# EAGLE schematic LED-Cube-Schematic (EAGLE 6.2)
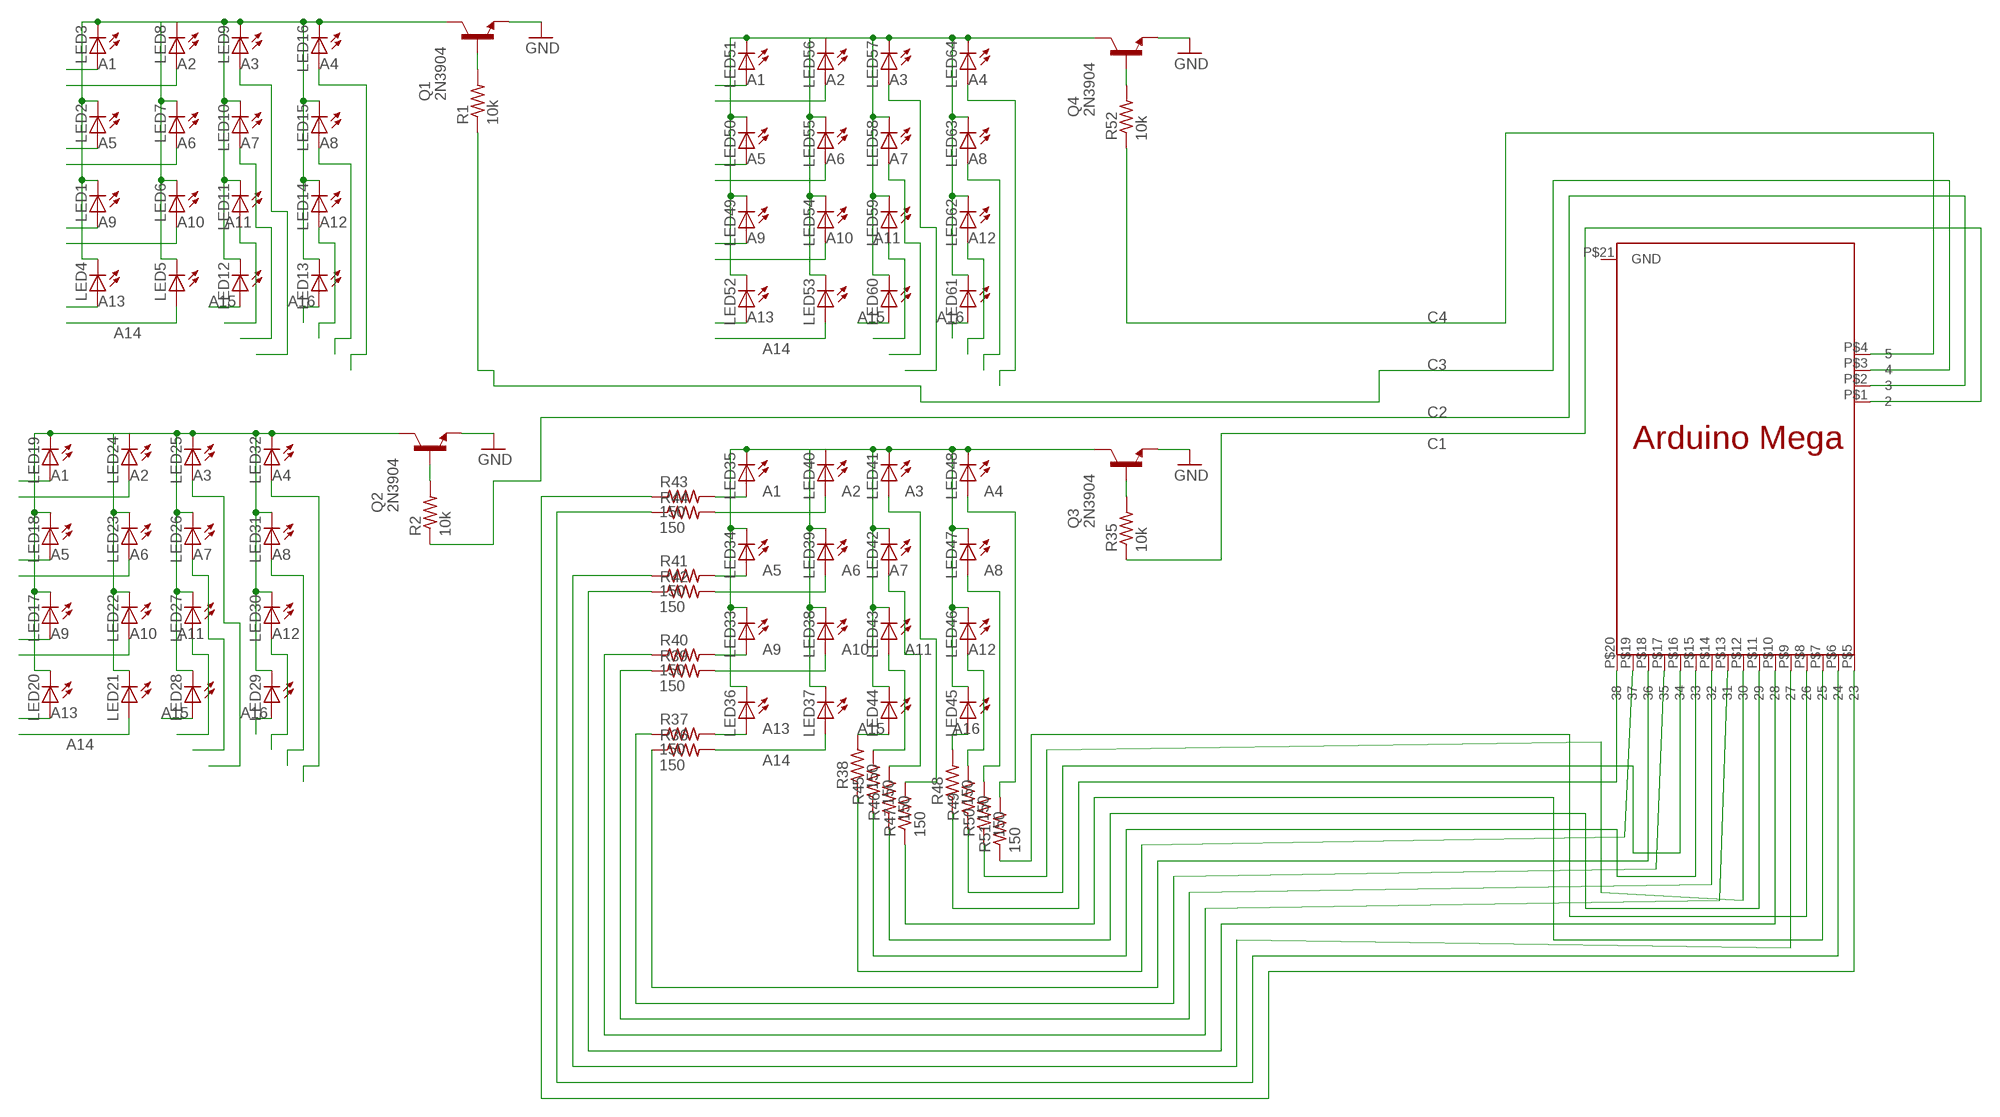
[diagram p0: schematic, sheet 1]

## Parts
LED1  LED3MM  [LED3MM]
LED2  LED3MM  [LED3MM]
LED3  LED3MM  [LED3MM]
LED4  LED3MM  [LED3MM]
LED5  LED3MM  [LED3MM]
LED6  LED3MM  [LED3MM]
LED7  LED3MM  [LED3MM]
LED8  LED3MM  [LED3MM]
LED9  LED3MM  [LED3MM]
LED10  LED3MM  [LED3MM]
LED11  LED3MM  [LED3MM]
LED12  LED3MM  [LED3MM]
LED13  LED3MM  [LED3MM]
LED14  LED3MM  [LED3MM]
LED15  LED3MM  [LED3MM]
LED16  LED3MM  [LED3MM]
LED17  LED3MM  [LED3MM]
LED18  LED3MM  [LED3MM]
LED19  LED3MM  [LED3MM]
LED20  LED3MM  [LED3MM]
LED21  LED3MM  [LED3MM]
LED22  LED3MM  [LED3MM]
LED23  LED3MM  [LED3MM]
LED24  LED3MM  [LED3MM]
LED25  LED3MM  [LED3MM]
LED26  LED3MM  [LED3MM]
LED27  LED3MM  [LED3MM]
LED28  LED3MM  [LED3MM]
LED29  LED3MM  [LED3MM]
LED30  LED3MM  [LED3MM]
LED31  LED3MM  [LED3MM]
LED32  LED3MM  [LED3MM]
LED33  LED3MM  [LED3MM]
LED34  LED3MM  [LED3MM]
LED35  LED3MM  [LED3MM]
LED36  LED3MM  [LED3MM]
LED37  LED3MM  [LED3MM]
LED38  LED3MM  [LED3MM]
LED39  LED3MM  [LED3MM]
LED40  LED3MM  [LED3MM]
LED41  LED3MM  [LED3MM]
LED42  LED3MM  [LED3MM]
LED43  LED3MM  [LED3MM]
LED44  LED3MM  [LED3MM]
LED45  LED3MM  [LED3MM]
LED46  LED3MM  [LED3MM]
LED47  LED3MM  [LED3MM]
LED48  LED3MM  [LED3MM]
LED49  LED3MM  [LED3MM]
LED50  LED3MM  [LED3MM]
LED51  LED3MM  [LED3MM]
LED52  LED3MM  [LED3MM]
LED53  LED3MM  [LED3MM]
LED54  LED3MM  [LED3MM]
LED55  LED3MM  [LED3MM]
LED56  LED3MM  [LED3MM]
LED57  LED3MM  [LED3MM]
LED58  LED3MM  [LED3MM]
LED59  LED3MM  [LED3MM]
LED60  LED3MM  [LED3MM]
LED61  LED3MM  [LED3MM]
LED62  LED3MM  [LED3MM]
LED63  LED3MM  [LED3MM]
LED64  LED3MM  [LED3MM]
Q1  2N3904  [TO92]
Q2  2N3904  [TO92]
Q3  2N3904  [TO92]
Q4  2N3904  [TO92]
R1  10k  R-US_0207/7  [0207/7]
R2  10k  R-US_0207/7  [0207/7]
R35  10k  R-US_0207/7  [0207/7]
R36  150  R-US_0207/7  [0207/7]
R37  150  R-US_0207/7  [0207/7]
R38  150  R-US_0207/7  [0207/7]
R39  150  R-US_0207/7  [0207/7]
R40  150  R-US_0207/7  [0207/7]
R41  150  R-US_0207/7  [0207/7]
R42  150  R-US_0207/7  [0207/7]
R43  150  R-US_0207/7  [0207/7]
R44  150  R-US_0207/7  [0207/7]
R45  150  R-US_0207/7  [0207/7]
R46  150  R-US_0207/7  [0207/7]
R47  150  R-US_0207/7  [0207/7]
R48  150  R-US_0207/7  [0207/7]
R49  150  R-US_0207/7  [0207/7]
R50  150  R-US_0207/7  [0207/7]
R51  150  R-US_0207/7  [0207/7]
R52  10k  R-US_0207/7  [0207/7]
U$1  MEGA  [MEGAPACKAGE]

## Nets
A1: LED3.A LED19.A LED35.A LED51.A R43.2
A2: LED8.A LED24.A LED40.A LED56.A R44.2
A3: LED9.A LED25.A LED41.A LED57.A R47.2
A4: LED16.A LED32.A LED48.A LED64.A R51.2
A5: LED2.A LED18.A LED34.A LED50.A R41.2
A6: LED7.A LED23.A LED39.A LED55.A R42.2
A7: LED10.A LED26.A LED42.A LED58.A R46.2
A8: LED15.A LED31.A LED47.A LED63.A R50.2
A9: LED1.A LED17.A LED33.A LED49.A R40.2
A10: LED6.A LED22.A LED38.A LED54.A R39.2
A11: LED11.A LED27.A LED43.A LED59.A R45.2
A12: LED14.A LED30.A LED46.A LED62.A R49.2
A13: LED4.A LED20.A LED36.A LED52.A R37.2
A14: LED5.A LED21.A LED37.A LED53.A R36.2
A15: LED12.A LED28.A LED44.A LED60.A R38.2
A16: LED13.A LED29.A LED45.A LED61.A R48.2
C1: R35.1
C2: R2.1
C3: R1.1
C4: R52.1
GND: Q1.3(E) Q2.3(E) Q3.3(E) Q4.3(E)
N$2: LED1.K(C) LED2.K(C) LED3.K(C) LED4.K(C) LED9.K(C) LED10.K(C) LED11.K(C) LED12.K(C) LED13.K(C) LED14.K(C) LED15.K(C) LED16.K(C) Q1.1(C)
N$3: LED5.K(C) LED6.K(C) LED7.K(C) LED8.K(C)
N$4: Q1.2(B) R1.2
N$5: LED17.K(C) LED18.K(C) LED19.K(C) LED20.K(C) LED25.K(C) LED26.K(C) LED27.K(C) LED28.K(C) LED29.K(C) LED30.K(C) LED31.K(C) LED32.K(C) Q2.1(C)
N$6: LED21.K(C) LED22.K(C) LED23.K(C) LED24.K(C)
N$7: Q2.2(B) R2.2
N$39: LED33.K(C) LED34.K(C) LED35.K(C) LED36.K(C) LED41.K(C) LED42.K(C) LED43.K(C) LED44.K(C) LED45.K(C) LED46.K(C) LED47.K(C) LED48.K(C) Q3.1(C)
N$40: LED37.K(C) LED38.K(C) LED39.K(C) LED40.K(C)
N$57: Q3.2(B) R35.2
N$58: LED49.K(C) LED50.K(C) LED51.K(C) LED52.K(C) LED57.K(C) LED58.K(C) LED59.K(C) LED60.K(C) LED61.K(C) LED62.K(C) LED63.K(C) LED64.K(C) Q4.1(C)
N$59: LED53.K(C) LED54.K(C) LED55.K(C) LED56.K(C)
N$76: Q4.2(B) R52.2
N$77: R51.1
N$78: R50.1
N$79: R49.1
N$80: R48.1
N$81: R47.1
N$82: R46.1
N$83: R45.1
N$84: R38.1
N$85: R36.1
N$86: R37.1
N$87: R39.1
N$88: R40.1
N$89: R42.1
N$90: R41.1
N$91: R44.1
N$92: R43.1
Unconnected: U$1.P$1 U$1.P$2 U$1.P$3 U$1.P$4 U$1.P$5 U$1.P$6 U$1.P$7 U$1.P$8 U$1.P$9 U$1.P$10 U$1.P$11 U$1.P$12 U$1.P$13 U$1.P$14 U$1.P$15 U$1.P$16 U$1.P$17 U$1.P$18 U$1.P$19 U$1.P$20 U$1.P$21(GND)

## Library data of the parts
LED1-LED64 = led:LED: LED OSRAM: - CHIPLED LG R971, LG N971, LY N971, LG Q971, LY Q971, LO R971, LY R971 LH N974, LH R974 LS Q976, LO Q976, LY Q976 LO Q996 - Hyper CHIPLED LW Q18S LB Q993, LB Q99A, LB R99A - SideLED LS A670, LO A670, LY A670, LG A670, LP A670 LB A673, LV A673, LT A673, LW A673 LH A674 LY A675 LS A676, LA A676, LO A676, LY A676, LW A676 LS A679, LY A679, LG A679 - Hyper Micro SIDELED® LS Y876, LA Y876, LO Y876, LY Y876 LT Y87S - SmartLED LW L88C, LW L88S LB L89C, LB L89S, LG L890 LS L89K, LO L89K, LY L89K LS L896, LA L896, LO L896, LY L896 - TOPLED LS T670, LO T670, LY T670, LG T670, LP T670 LSG T670, LSP T670, LSY T670, LOP T670, LYG T670 LG T671, LOG T671, LSG T671 LB T673, LV T673, LT T673, LW T673 LH T674 LS T676, LA T676, LO T676, LY T676, LB T676, LH T676, LSB T676, LW T676 LB T67C, LV T67C, LT T67C, LS T67K, LO T67K, LY T67K, LW E67C LS E67B, LA E67B, LO E67B, LY E67B, LB E67C, LV E67C, LT E67C LW T67C LS T679, LY T679, LG T679 LS T770, LO T770, LY T770, LG T770, LP T770 LB T773, LV T773, LT T773, LW T773 LH T774 LS E675, LA E675, LY E675, LS T675 LS T776, LA T776, LO T776, LY T776, LB T776 LHGB T686 LT T68C, LB T68C - Hyper Mini TOPLED® LB M676 - Mini TOPLED Santana® LG M470 LS M47K, LO M47K, LY M47K Source: http://www.osram.convergy.de LUXEON: - LUMILED® LXK2-PW12-R00, LXK2-PW12-S00, LXK2-PW14-U00, LXK2-PW14-V00 LXK2-PM12-R00, LXK2-PM12-S00, LXK2-PM14-U00 LXK2-PE12-Q00, LXK2-PE12-R00, LXK2-PE12-S00, LXK2-PE14-T00, LXK2-PE14-U00 LXK2-PB12-K00, LXK2-PB12-L00, LXK2-PB12-M00, LXK2-PB14-N00, LXK2-PB14-P00, LXK2-PB14-Q00 LXK2-PR12-L00, LXK2-PR12-M00, LXK2-PR14-Q00, LXK2-PR14-R00 LXK2-PD12-Q00, LXK2-PD12-R00, LXK2-PD12-S00 LXK2-PH12-R00, LXK2-PH12-S00 LXK2-PL12-P00, LXK2-PL12-Q00, LXK2-PL12-R00 Source: www.luxeon.com KINGBRIGHT: KA-3528ASYC Source: www.kingbright.com
Q1-Q4 = transistor-npn:2N3904: NPN Transistor
R1 R2 R35-R37 R39-R44 R52 = resistor:R-US_: RESISTOR, American symbol
R38 R45-R51 = resistor:R-US_: RESISTOR, American symbol; R1: 150
U$1 = Chris' Library:MEGA